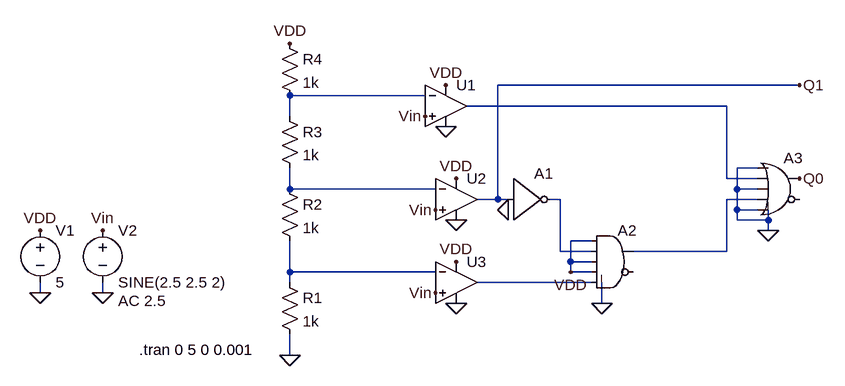
[diagram p0: schematic adc_2bit.asc]
adc_2bit.asc, the LTspice schematic file:
Version 4.1
SHEET 1 1264 680
WIRE 1104 -144 640 -144
WIRE 528 -128 320 -128
WIRE 992 -112 592 -112
WIRE 320 -96 320 -128
WIRE 1040 -16 1008 -16
WIRE 992 0 992 -112
WIRE 1040 0 992 0
WIRE 320 16 320 -16
WIRE 544 16 320 16
WIRE 1008 16 1008 -16
WIRE 1040 16 1008 16
WIRE 640 32 640 -144
WIRE 640 32 608 32
WIRE 656 32 640 32
WIRE 736 32 720 32
WIRE 1040 32 992 32
WIRE 1008 48 1008 16
WIRE 1040 48 1008 48
WIRE 1008 64 1008 48
WIRE 1056 64 1056 48
WIRE 1056 64 1008 64
WIRE 1056 80 1056 64
WIRE 784 96 752 96
WIRE 736 112 736 32
WIRE 784 112 736 112
WIRE 992 112 992 32
WIRE 992 112 848 112
WIRE 752 128 752 96
WIRE 784 128 752 128
WIRE 320 144 320 96
WIRE 544 144 320 144
WIRE 752 144 752 128
WIRE 784 144 752 144
WIRE 320 160 320 144
WIRE 784 160 608 160
WIRE -64 176 -64 160
WIRE 32 176 32 160
WIRE 800 192 800 160
WIRE 320 272 320 240
FLAG -64 176 0
FLAG 32 176 0
FLAG -64 80 VDD
FLAG 32 80 Vin
FLAG 320 -208 VDD
FLAG 560 -144 VDD
FLAG 576 0 VDD
FLAG 576 128 VDD
FLAG 560 -80 0
FLAG 576 64 0
FLAG 576 192 0
FLAG 320 272 0
FLAG 528 -96 Vin
FLAG 544 48 Vin
FLAG 544 176 Vin
FLAG 1104 0 Q0
FLAG 1104 -144 Q1
FLAG 1056 80 0
FLAG 752 144 VDD
FLAG 800 192 0
FLAG 656 48 0
SYMBOL voltage -64 64 R0
SYMATTR InstName V1
SYMATTR Value 5
SYMBOL voltage 32 64 R0
WINDOW 123 24 124 Left 2
WINDOW 39 0 0 Left 0
SYMATTR Value2 AC 2.5
SYMATTR InstName V2
SYMATTR Value SINE(2.5 2.5 2)
SYMBOL res 304 0 R0
SYMATTR InstName R2
SYMATTR Value 1k
SYMBOL res 304 -112 R0
SYMATTR InstName R3
SYMATTR Value 1k
SYMBOL res 304 -224 R0
SYMATTR InstName R4
SYMATTR Value 1k
SYMBOL OpAmps\\UniversalOpAmp2 560 -112 R0
SYMATTR InstName U1
SYMBOL OpAmps\\UniversalOpAmp2 576 32 R0
SYMATTR InstName U2
SYMBOL OpAmps\\UniversalOpAmp2 576 160 R0
SYMATTR InstName U3
SYMBOL res 304 144 R0
SYMATTR InstName R1
SYMATTR Value 1k
SYMBOL Digital\\inv 656 -32 R0
WINDOW 3 8 60 Invisible 0
SYMATTR InstName A1
SYMATTR Value Vhigh=5 Vlow=0
SYMBOL Digital\\and 816 64 R0
WINDOW 3 16 52 Invisible 2
SYMATTR InstName A2
SYMATTR Value Vhigh=5 Vlow=0
SYMBOL Digital\\or 1072 -48 R0
WINDOW 3 -8 36 Invisible 2
SYMATTR InstName A3
SYMATTR Value Vhigh=5 Vlow=0
TEXT 88 264 Left 2 !.tran 0 5 0 0.001

The netlist it stands for:
* adc_2bit.asc
V1 VDD 0 5
V2 Vin 0 SINE(2.5 2.5 2) AC 2.5
R2 N003 N006 1k
R3 N001 N003 1k
R4 VDD N001 1k
X§U1 Vin N001 VDD 0 N002 level2 Avol=1Meg GBW=10Meg Slew=10Meg Ilimit=25m Rail=0 Vos=0 En=0 Enk=0 In=0 Ink=0 Rin=500Meg  ; pins In+ In- V+ V- OUT
X§U2 Vin N003 VDD 0 Q1 level2 Avol=1Meg GBW=10Meg Slew=10Meg Ilimit=25m Rail=0 Vos=0 En=0 Enk=0 In=0 Ink=0 Rin=500Meg  ; pins In+ In- V+ V- OUT
X§U3 Vin N006 VDD 0 N007 level2 Avol=1Meg GBW=10Meg Slew=10Meg Ilimit=25m Rail=0 Vos=0 En=0 Enk=0 In=0 Ink=0 Rin=500Meg  ; pins In+ In- V+ V- OUT
R1 N006 0 1k
A1 Q1 0 0 0 0 N004 0 0 BUF Vhigh=5 Vlow=0
A2 VDD N004 VDD VDD N007 0 N005 0 AND Vhigh=5 Vlow=0
A3 0 N002 0 N005 0 0 Q0 0 OR Vhigh=5 Vlow=0
.tran 0 5 0 0.001
.lib UniversalOpAmp2.lib
.backanno
.end